# Altium project UbiWatch.PrjPcb
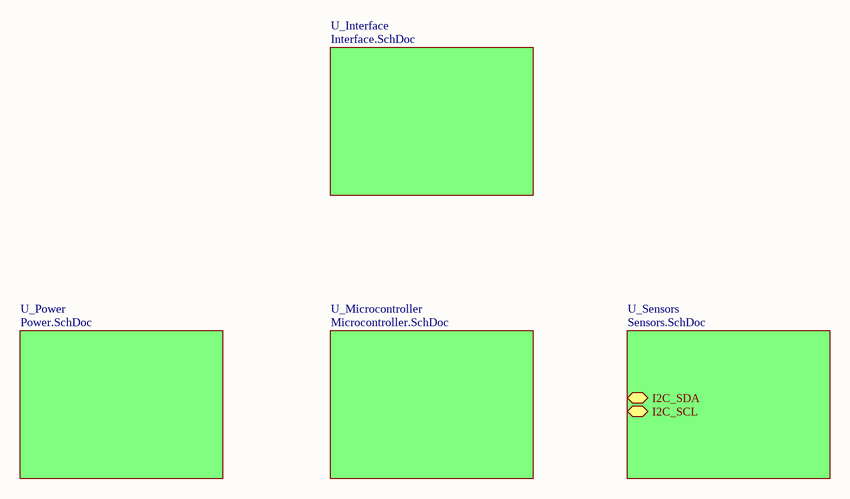
[diagram p0: UbiWatch.SchDoc]
5 sheets, 62 parts. Net scope: hierarchical (ports join the sheet entries above them; power ports are global).
Board file: UbiWatch.PcbDoc
Sheets:
  UbiWatch.SchDoc
    U_Microcontroller = Microcontroller.SchDoc
    U_Power = Power.SchDoc
    U_Interface = Interface.SchDoc
    U_Sensors = Sensors.SchDoc

## Sheet UbiWatch.SchDoc
size A; SheetNumber: 1; SheetTotal: 5

### Sub-sheets
U_Interface = Interface.SchDoc: no entries
U_Microcontroller = Microcontroller.SchDoc: no entries
U_Power = Power.SchDoc: no entries
U_Sensors = Sensors.SchDoc: I2C_SDA (bidir), I2C_SCL (bidir)

## Sheet Microcontroller.SchDoc
size A; SheetNumber: 2; SheetTotal: 4
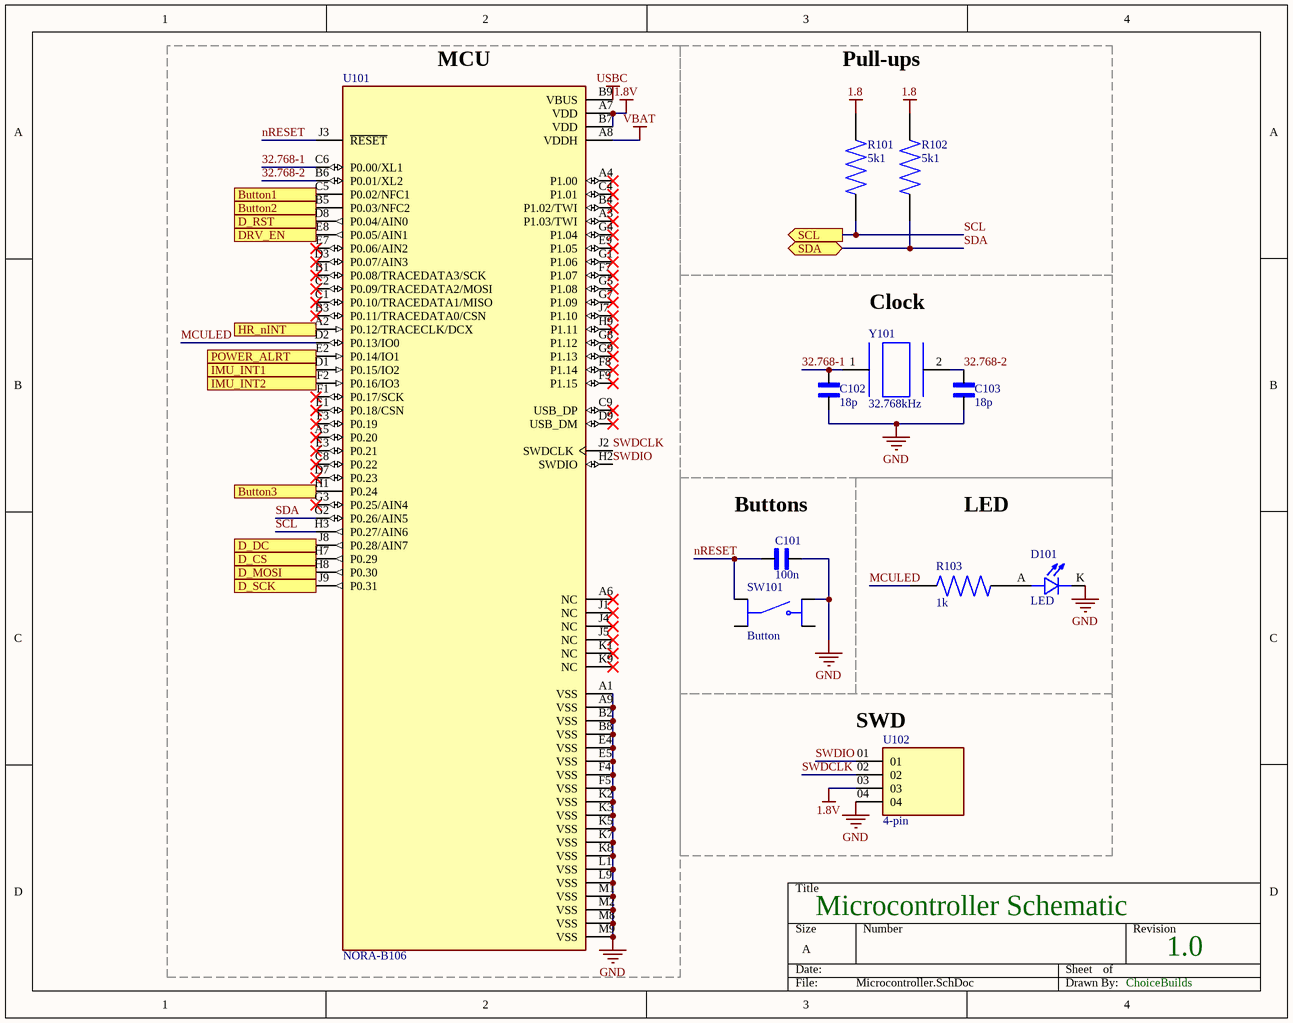
[diagram p1: Microcontroller.SchDoc]

### Parts
C101  100n  [0402c]
C102  18p  [0402c]
C103  18p  [0402c]
D101  LED  [.LED]
R101  5k1  [0402r]
R102  5k1  [0402r]
R103  1k  [0402r]
SW101  Button  [.Button]
U101  NORA-B106  [NORA-B106]
U102  4-pin  [4-pin]
Y101  32.768kHz  [32.768kHz]

### Blocks framed on the sheet
MCU: U101
Pull-ups: R101 R102
Clock: C102 C103 Y101
Buttons: C101 SW101
LED: D101 R103
SWD: U102

### Ports
Button1 (in), Button2 (in), Button3 (in), D_CS (out), D_DC (out), D_MOSI (out), D_RST (out), D_SCK (out), DRV_EN (out), HR_nINT (in), IMU_INT1 (in), IMU_INT2 (in), POWER_ALRT (in), SCL (out), SDA (bidir)

### Nets
1.8: R101.2 R102.2
1.8V: U101.A7(VDD) U101.B7(VDD) U102.03
GND: C101.2 C102.1 C103.1 D101.K SW101.B1 U101.A1(VSS) U101.A9(VSS) U101.B2(VSS) U101.B8(VSS) U101.E4(VSS) U101.E5(VSS) U101.F4(VSS) U101.F5(VSS) U101.K2(VSS) U101.K3(VSS) U101.K5(VSS) U101.K7(VSS) U101.K8(VSS) U101.L1(VSS) U101.L9(VSS) U101.M1(VSS) U101.M2(VSS) U101.M8(VSS) U101.M9(VSS) U102.04
USBC: U101.B9(VBUS)
VBAT: U101.A8(VDDH)
32.768-1: C102.2 U101.C6(P0.00/XL1) Y101.1
32.768-2: C103.2 U101.B6(P0.01/XL2) Y101.2
MCULED: R103.1 U101.D2(P0.13/IO0)
nRESET: C101.1 SW101.A1 U101.J3(~{RESET})
SCL: R101.1 U101.H3(P0.27/AIN6) ; port SCL
SDA: R102.1 U101.G2(P0.26/AIN5) ; port SDA
SWDCLK: U101.J2(SWDCLK) U102.02
SWDIO: U101.H2(SWDIO) U102.01
NetD101_A: D101.A R103.2
NetU101_A2: U101.A2(P0.12/TRACECLK/DCX) ; port HR_nINT
NetU101_B5: U101.B5(P0.03/NFC2) ; port Button2
NetU101_C5: U101.C5(P0.02/NFC1) ; port Button1
NetU101_D1: U101.D1(P0.15/IO2) ; port IMU_INT1
NetU101_D8: U101.D8(P0.04/AIN0) ; port D_RST
NetU101_E2: U101.E2(P0.14/IO1) ; port POWER_ALRT
NetU101_E8: U101.E8(P0.05/AIN1) ; port DRV_EN
NetU101_F2: U101.F2(P0.16/IO3) ; port IMU_INT2
NetU101_H1: U101.H1(P0.24) ; port Button3
NetU101_H7: U101.H7(P0.29) ; port D_CS
NetU101_H8: U101.H8(P0.30) ; port D_MOSI
NetU101_J8: U101.J8(P0.28/AIN7) ; port D_DC
NetU101_J9: U101.J9(P0.31) ; port D_SCK

Not connected (* = marked no-connect by the designer): SW101 A2 B2; U101 A3(P1.03/TWI)* A4(P1.00)* A5(P0.20)* A6(NC)* B1(P0.08/TRACEDATA3/SCK)* B3(P0.11/TRACEDATA0/CSN)* B4(P1.02/TWI)* C1(P0.10/TRACEDATA1/MISO)* C2(P0.09/TRACEDATA2/MOSI)* C4(P1.01)* C8(P0.22)* C9(USB_DP)* D3(P0.07/AIN3)* D7(P0.23)* D9(USB_DM)* E1(P0.18/CSN)* E3(P0.21)* E7(P0.06/AIN2)* E9(P1.05)* F1(P0.17/SCK)* F3(P0.19)* F7(P1.07)* F8(P1.14)* F9(P1.15)* G1(P1.06)* G3(P0.25/AIN4)* G4(P1.04)* G5(P1.08)* G7(P1.09)* G8(P1.12)* G9(P1.13)* H9(P1.11)* J1(NC)* J4(NC)* J5(NC)* J7(P1.10)* K1(NC)* K9(NC)*

### Notes on the sheet
- Microcontroller Schematic
- 1.0
- ChoiceBuilds

### Library data of the parts
C101-C103 = 0402c
D101 = .LED
R101-R103 = 0402r
SW101 = .Button

## Sheet Power.SchDoc
size A; SheetNumber: 3; SheetTotal: 4
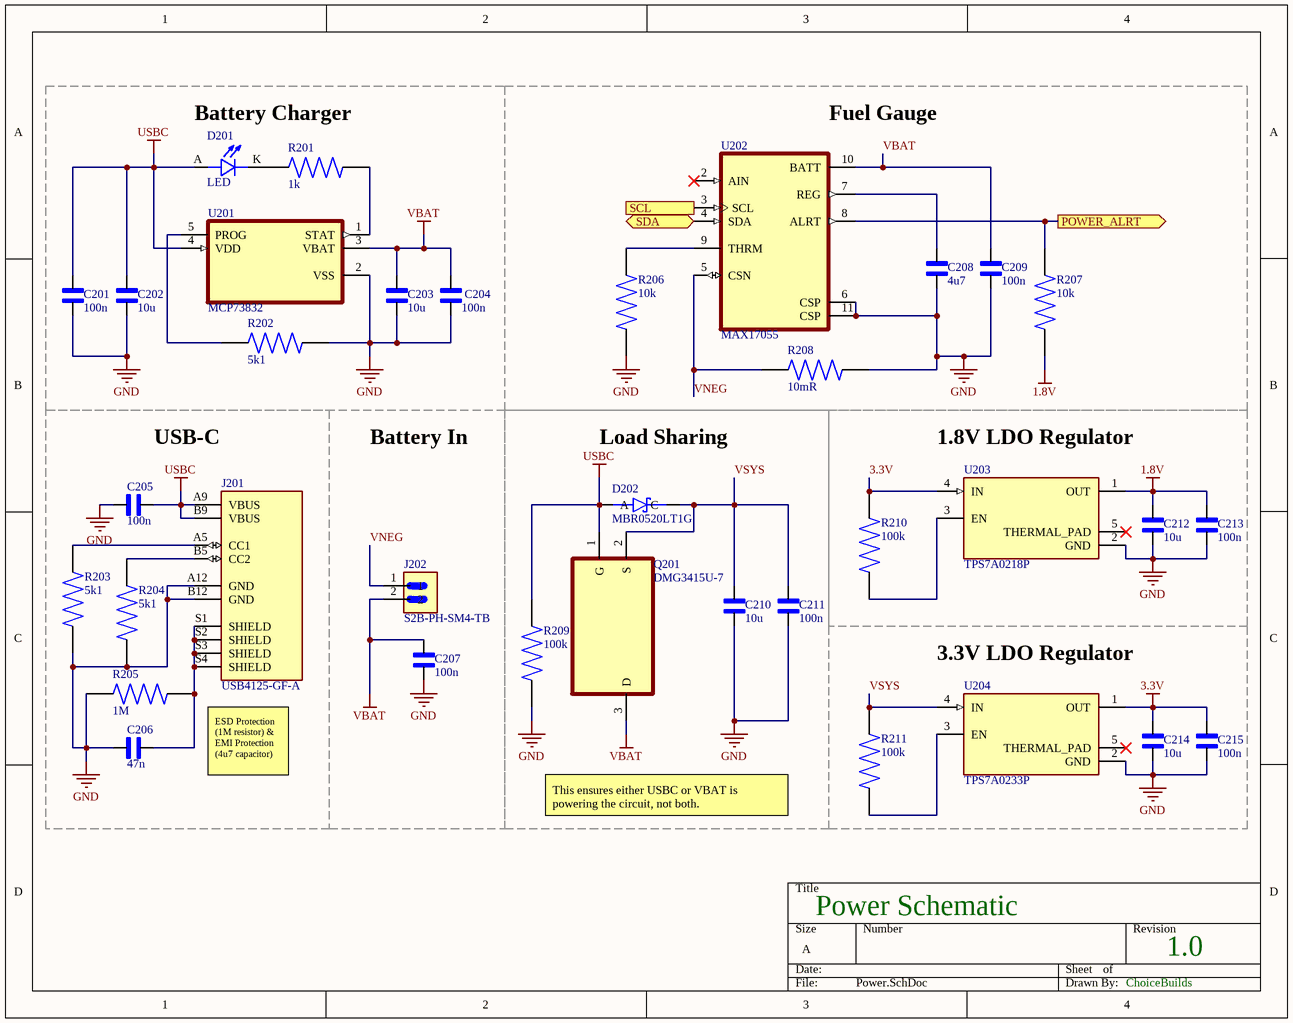
[diagram p2: Power.SchDoc]

### Parts
C201  100n  [0402c]
C202  10u  [0603c]
C203  10u  [0603c]
C204  100n  [0402c]
C205  100n  [0402c]
C206  47n  [0402c]
C207  100n  [0402c]
C208  4u7  [0603c]
C209  100n  [0402c]
C210  10u  [0603c]
C211  100n  [0402c]
C212  10u  [0603c]
C213  100n  [0402c]
C214  10u  [0603c]
C215  100n  [0402c]
D201  LED  [.LED]
D202  MBR0520LT1G  [MBR0520LT1G]
J201  USB4125-GF-A  [USB4125-GF-A]
J202  S2B-PH-SM4-TB  [S2B-PH-SM4-TB]
Q201  DMG3415U-7  [DMG3415U-7]
R201  1k  [0402r]
R202  5k1  [0402r]
R203  5k1  [0402r]
R204  5k1  [0402r]
R205  1M  [0402r]
R206  10k  [0402r]
R207  10k  [0402r]
R208  10mR  [0805r]
R209  100k  [0402r]
R210  100k  [0402r]
R211  100k  [0402r]
U201  MCP73832  [MCP73832]
U202  MAX17055  [MAX17055]
U203  TPS7A0218P  [TPS7A0218P]
U204  TPS7A0233P  [TPS7A0233P]

### Blocks framed on the sheet
Battery Charger: C201-C204 D201 R201 R202 U201
Fuel Gauge: C208 C209 R206-R208 U202
USB-C: C205 C206 J201 R203-R205
Battery In: C207 J202
Load Sharing: C210 C211 D202 Q201 R209
1.8V LDO Regulator: C212 C213 R210 U203
3.3V LDO Regulator: C214 C215 R211 U204

### Ports
POWER_ALRT (out), SCL (in), SDA (bidir)

### Nets
1.8V: C212.2 C213.2 R207.1 U203.1(OUT)
3.3V: C214.2 C215.2 R210.2 U203.4(IN) U204.1(OUT)
GND: C201.1 C202.1 C203.1 C204.1 C205.1 C206.1 C207.2 C208.1 C209.1 C210.1 C211.1 C212.1 C213.1 C214.1 C215.1 J201.A12(GND) J201.B12(GND) R202.2 R203.1 R204.1 R205.1 R206.1 R208.2 R209.1 U201.2(VSS) U202.6(CSP) U202.11(CSP) U203.2(GND) U204.2(GND)
USBC: C201.2 C202.2 C205.2 D201.A D202.A J201.A9(VBUS) J201.B9(VBUS) Q201.1(G) R209.2 U201.4(VDD)
VBAT: C203.2 C204.2 C207.1 C209.2 J202.2 Q201.3(D) U201.3(VBAT) U202.10(BATT)
VNEG: J202.1 R208.1 U202.5(CSN)
VSYS: C210.2 C211.2 D202.C Q201.2(S) R211.2 U204.4(IN)
NetC206_2: C206.2 J201.S1(SHIELD) J201.S2(SHIELD) J201.S3(SHIELD) J201.S4(SHIELD) R205.2
NetC208_2: C208.2 U202.7(REG)
NetD201_K: D201.K R201.1
NetJ201_A5: J201.A5(CC1) R203.2
NetJ201_B5: J201.B5(CC2) R204.2
NetR201_2: R201.2 U201.1(STAT)
NetR202_1: R202.1 U201.5(PROG)
NetR206_2: R206.2 U202.9(THRM)
NetR207_2: R207.2 U202.8(ALRT) ; port POWER_ALRT
NetR210_1: R210.1 U203.3(EN)
NetR211_1: R211.1 U204.3(EN)
NetU202_3: U202.3(SCL) ; port SCL
NetU202_4: U202.4(SDA) ; port SDA

Not connected (* = marked no-connect by the designer): U202 2(AIN)*; U203 5(THERMAL_PAD)*; U204 5(THERMAL_PAD)*

### Notes on the sheet
- ESD Protection (1M resistor) & EMI Protection (4u7 capacitor)
- This ensures either USBC or VBAT is powering the circuit, not both.
- Power Schematic
- 1.0
- ChoiceBuilds

### Library data of the parts
C201 C204-C207 C209 C211 C213 C215 = 0402c
C202 C203 C208 C210 C212 C214 = 0603c
D201 = .LED
R201-R207 R209-R211 = 0402r
R208 = 0805r

## Sheet Interface.SchDoc
size A; SheetNumber: 4; SheetTotal: 5
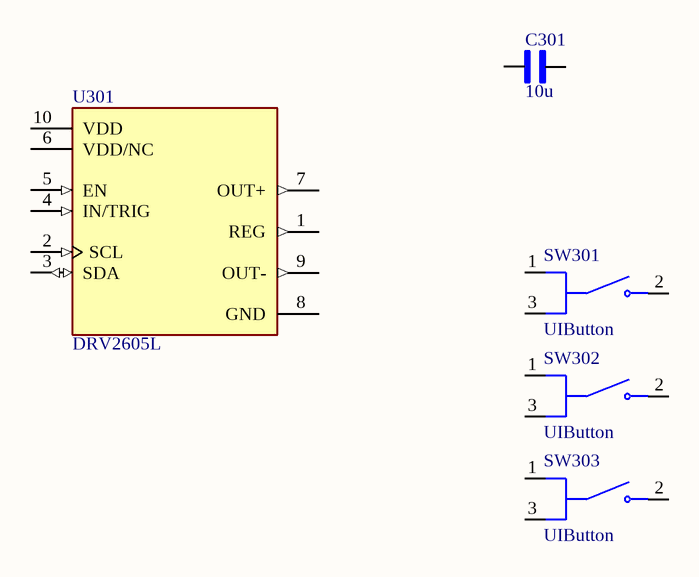
[diagram p3: Interface.SchDoc]

### Parts
C301  10u  [0603c]
SW301  UIButton  [TL3340AF160QG]
SW302  UIButton  [TL3340AF160QG]
SW303  UIButton  [TL3340AF160QG]
U301  DRV2605L  [DRV2605L]

### Nets

Not connected (* = marked no-connect by the designer): C301 1 2; SW301 1(COM_1) 2(NO) 3(COM_2); SW302 1(COM_1) 2(NO) 3(COM_2); SW303 1(COM_1) 2(NO) 3(COM_2); U301 1(REG) 2(SCL) 3(SDA) 4(IN/TRIG) 5(EN) 6(VDD/NC) 7(OUT+) 8(GND) 9(OUT-) 10(VDD)

### Library data of the parts
C301 = 0603c
SW301-SW303 = TL3340AF160QG

## Sheet Sensors.SchDoc
size A; SheetNumber: 5; SheetTotal: 5
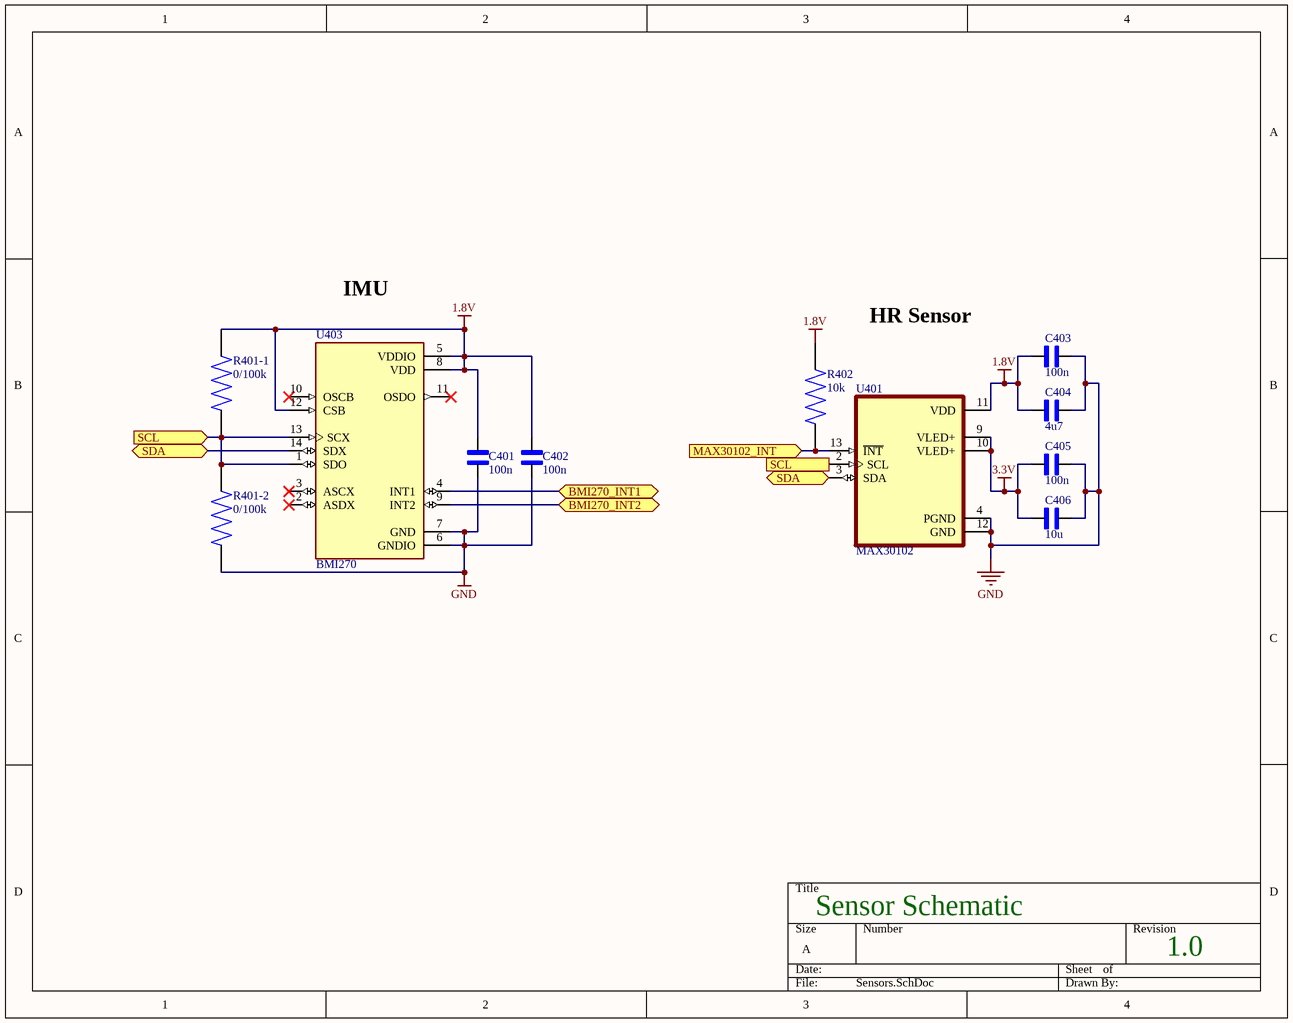
[diagram p4: Sensors.SchDoc]

### Parts
C401  100n  [0402c]
C402  100n  [0402c]
C403  100n  [0402c]
C404  4u7  [0603c]
C405  100n  [0402c]
C406  10u  [0603c]
R401-1  0/100k  [0402r]
R401-2  0/100k  [0402r]
R402  10k  [0402r]
U401  MAX30102  [MAX30102]
U403  BMI270  [BMI270]

### Ports
BMI270_INT1 (bidir), BMI270_INT2 (bidir), MAX30102_INT (in), SCL (in), SDA (bidir)

### Nets
1.8V: C401.2 C402.2 C403.2 C404.2 R401-1.2 R402.2 U401.11(VDD) U403.5(VDDIO) U403.8(VDD) U403.12(CSB)
3.3V: C405.2 C406.2 U401.9(VLED+) U401.10(VLED+)
GND: C401.1 C402.1 C403.1 C404.1 C405.1 C406.1 R401-2.1 U401.4(PGND) U401.12(GND) U403.6(GNDIO) U403.7(GND)
NetR401-1_1: R401-1.1 R401-2.2 U401.2(SCL) U403.1(SDO) U403.13(SCX) ; port SCL
NetR402_1: R402.1 U401.13(~{INT}) ; port MAX30102_INT
NetU401_3: U401.3(SDA) U403.14(SDX) ; port SDA
NetU403_4: U403.4(INT1) ; port BMI270_INT1
NetU403_9: U403.9(INT2) ; port BMI270_INT2

Not connected (* = marked no-connect by the designer): U403 2(ASDX)* 3(ASCX)* 10(OSCB)* 11(OSDO)*

### Notes on the sheet
- IMU
- HR Sensor
- Sensor Schematic
- 1.0

### Library data of the parts
C401-C403 C405 = 0402c
C404 C406 = 0603c
R401-1 R401-2 R402 = 0402r

## Nets that join several sheets
1.8V: Microcontroller (U101.A7 U101.B7 U102.03), Power (C212.2 C213.2 R207.1 U203.1), Sensors (10 pins)
3.3V: Power (5 pins), Sensors (C405.2 C406.2 U401.9 U401.10)
GND: Microcontroller (25 pins), Power (29 pins), Sensors (11 pins)
USBC: Microcontroller (U101.B9), Power (10 pins)
VBAT: Microcontroller (U101.A8), Power (8 pins)